# Altium schematic sheet 信号调理.SchDoc
size A4; SheetNumber: 2; SheetTotal: 2
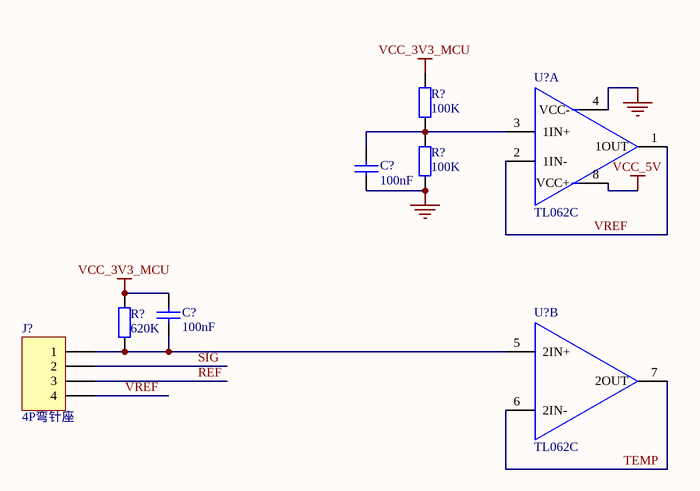
[diagram p0: 信号调理.SchDoc]

## Parts
(Parts that share a designator on the sheet are numbered #1, #2 ... from top to bottom, then left to right.)
C?#1  value 100nF  [0603CAP]  (hidden comment: SMDCAP00013)
C?#2  value 100nF  [0603CAP]  (hidden comment: SMDCAP00013)
J?  value 4P弯针座  [XH2.54-4PW]  (hidden comment: SL000000034)
R?#1  value 100K  [0603RES]  (hidden comment: SMDRES00071)
R?#2  value 100K  [0603RES]  (hidden comment: SMDRES00071)
R?#3  value 620K  [0603RES]  (hidden comment: SMDRES00071)
U?#1  TL062C  [SO-8]  (part A of 2)
U?#2  TL062C  [SO-8]  (part B of 2)

## Nets
GND: C?#1.1 R?#2.1 U?#1.4(VCC-)
VCC_3V3_MCU: C?#2.2 R?#1.2 R?#3.2
VCC_5V: U?#1.8(VCC+)
REF: J?.3
SIG: J?.2
TEMP: U?#2.6(2IN-) U?#2.7(2OUT)
VREF: J?.4 U?#1.1(1OUT) U?#1.2(1IN-)
NetC?#1_2: C?#1.2 R?#1.1 R?#2.2 U?#1.3(1IN+)
NetC?#2_1: C?#2.1 J?.1 R?#3.1 U?#2.5(2IN+)

## Library data of the parts
C?#1 C?#2 = MLCC 100nF 50V ±10％ 0603: 贴片电容
J? = XH2.54mm-4AW 弯针座: 4P弯针座
R?#1-R?#3 = Chip 100K 1/16W ±1％ 0603: 贴片电阻